# EAGLE design Bozarth_Laser_1 (EAGLE 7.6.0)
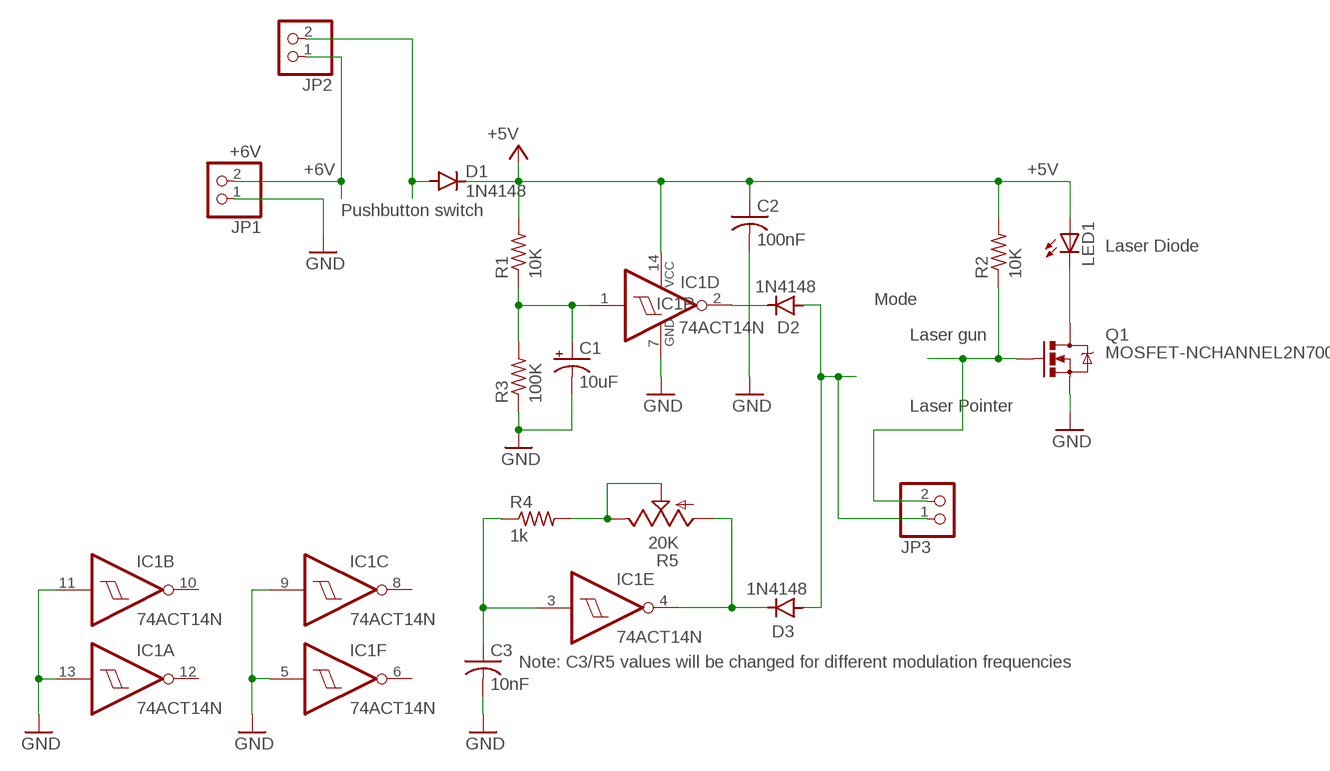
[diagram p0: schematic, sheet 1]

## Parts
C1  10uF  CPOL-USE2-5  [E2-5]
C2  100nF  C-US025-025X050  [C025-025X050]
C3  10nF  C-US025-025X050  [C025-025X050]
D1  1N4148  [0207/2V-D]
D2  1N4148  [0207/2V-D]
D3  1N4148  [0207/2V-D]
IC1  74ACT14N  [DIL14]
JP1  +6V  PINHD-1X2  [1X02]
JP2  PINHD-1X2  [1X02]
JP3  PINHD-1X2  [1X02]
LED1  LED5MM  [LED5MM]
Q1  MOSFET-NCHANNEL2N7000  [TO-92]
R1  10K  R-US_0207/10  [0207/10]
R2  10K  R-US_0207/10  [0207/10]
R3  100K  R-US_0207/10  [0207/10]
R4  1k  R-US_0207/10  [0207/10]
R5  20K  TRIM_US-B64Y  [B64Y]

## Nets
+5V: C2.1 D1.K(C) IC1.14(P:VCC) LED1.A R1.2 R2.2
+6V: JP1.2 JP2.1
GND: C1.- C2.2 C3.2 IC1.5(F:I) IC1.7(P:GND) IC1.9(C:I) IC1.11(B:I) IC1.13(A:I) JP1.1 Q1.1(S) R3.1
N$1: C1.+ IC1.1(D:I) R1.1 R3.2
N$2: D2.A D3.A JP3.1
N$3: LED1.K(C) Q1.3(D)
N$4: D1.A JP2.2
N$9: D2.K(C) IC1.2(D:O)
N$14: D3.K(C) IC1.4(E:O) R5.A
N$15: R4.2 R5.E R5.S
N$16: C3.1 IC1.3(E:I) R4.1
N$21: JP3.2 Q1.2(G) R2.1
Unconnected: IC1.6(F:O) IC1.8(C:O) IC1.10(B:O) IC1.12(A:O)

## Notes on the sheet
- Pushbutton switch
- Laser Diode
- Mode
- Laser gun
- Laser Pointer
- Note: C3/R5 values will be changed for different modulation frequencies

## Library data of the parts
C1 = rcl:CPOL-US: POLARIZED CAPACITOR, American symbol
C2 C3 = rcl:C-US: CAPACITOR, American symbol
D1-D3 = ideal_elements:1N4148
IC1 = 74xx-eu:74*14: Hex schmitt trigger INVERTER
JP1-JP3 = pinhead:PINHD-1X2: PIN HEADER
LED1 = led:LED: LED OSRAM: - CHIPLED LG R971, LG N971, LY N971, LG Q971, LY Q971, LO R971, LY R971 LH N974, LH R974 LS Q976, LO Q976, LY Q976 LO Q996 - Hyper CHIPLED LW Q18S LB Q993, LB Q99A, LB R99A - SideLED LS A670, LO A670, LY A670, LG A670, LP A670 LB A673, LV A673, LT A673, LW A673 LH A674 LY A675 LS A676, LA A676, LO A676, LY A676, LW A676 LS A679, LY A679, LG A679 - Hyper Micro SIDELED® LS Y876, LA Y876, LO Y876, LY Y876 LT Y87S - SmartLED LW L88C, LW L88S LB L89C, LB L89S, LG L890 LS L89K, LO L89K, LY L89K LS L896, LA L896, LO L896, LY L896 - TOPLED LS T670, LO T670, LY T670, LG T670, LP T670 LSG T670, LSP T670, LSY T670, LOP T670, LYG T670 LG T671, LOG T671, LSG T671 LB T673, LV T673, LT T673, LW T673 LH T674 LS T676, LA T676, LO T676, LY T676, LB T676, LH T676, LSB T676, LW T676 LB T67C, LV T67C, LT T67C, LS T67K, LO T67K, LY T67K, LW E67C LS E67B, LA E67B, LO E67B, LY E67B, LB E67C, LV E67C, LT E67C LW T67C LS T679, LY T679, LG T679 LS T770, LO T770, LY T770, LG T770, LP T770 LB T773, LV T773, LT T773, LW T773 LH T774 LS E675, LA E675, LY E675, LS T675 LS T776, LA T776, LO T776, LY T776, LB T776 LHGB T686 LT T68C, LB T68C - Hyper Mini TOPLED® LB M676 - Mini TOPLED Santana® LG M470 LS M47K, LO M47K, LY M47K Source: http://www.osram.convergy.de LUXEON: - LUMILED® LXK2-PW12-R00, LXK2-PW12-S00, LXK2-PW14-U00, LXK2-PW14-V00 LXK2-PM12-R00, LXK2-PM12-S00, LXK2-PM14-U00 LXK2-PE12-Q00, LXK2-PE12-R00, LXK2-PE12-S00, LXK2-PE14-T00, LXK2-PE14-U00 LXK2-PB12-K00, LXK2-PB12-L00, LXK2-PB12-M00, LXK2-PB14-N00, LXK2-PB14-P00, LXK2-PB14-Q00 LXK2-PR12-L00, LXK2-PR12-M00, LXK2-PR14-Q00, LXK2-PR14-R00 LXK2-PD12-Q00, LXK2-PD12-R00, LXK2-PD12-S00 LXK2-PH12-R00, LXK2-PH12-S00 LXK2-PL12-P00, LXK2-PL12-Q00, LXK2-PL12-R00 Source: www.luxeon.com KINGBRIGHT: KA-3528ASYC Source: www.kingbright.com
Q1 = SparkFun-DiscreteSemi:MOSFET-NCHANNEL: Common NMOSFET Parts MFG P/N Store ID Prod ID FDD8780 TRANS-09984 SI7820DN TRANS-11055 FDS6630A IC-08089 2N7002PW TRANS-11151 FQP30N06L COM-10213 TRANS-10060 BSS123LT1G TRANS-08345 BSS138 TRANS-00830 BS170 2N7000
R1-R4 = rcl:R-US_: RESISTOR, American symbol
R5 = JPG_16v1:TRIM_US-: POTENTIOMETER

## Board
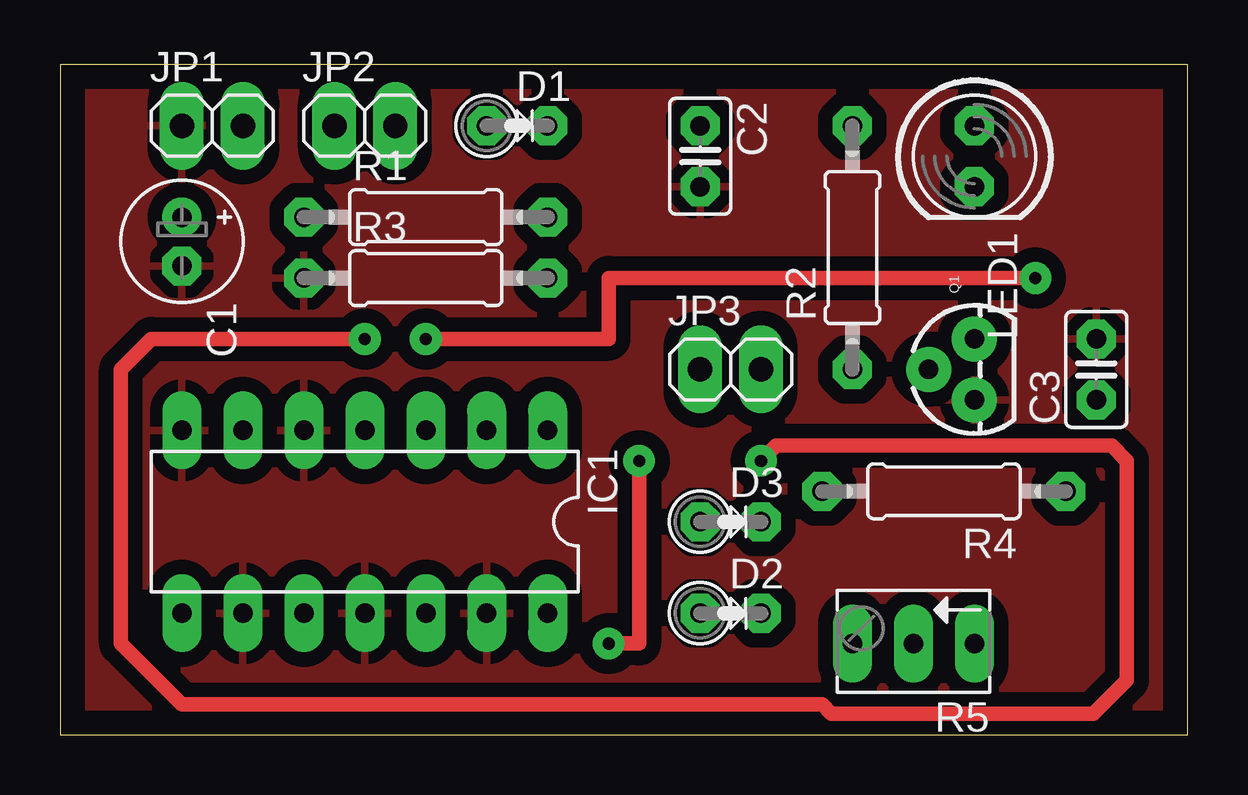
[diagram p1: board, top side]
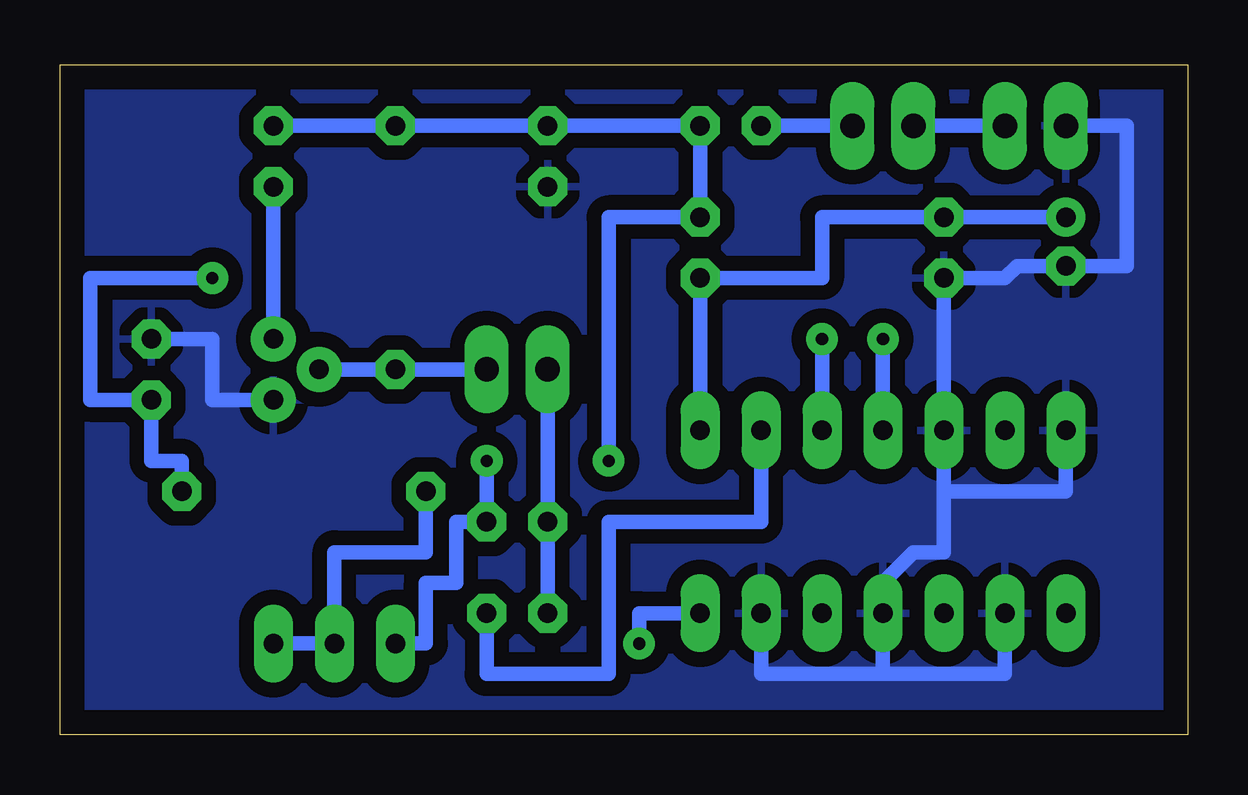
[diagram p2: board, bottom side, seen from below]

Size 46.99 x 27.94 mm. Coordinates in mm from the lower left corner, seen from the top.
Outline: 0,0 46.99,0 46.99,27.94 0,27.94 0,0
Copper layers (1*16): Top 0.035mm / dielectric 1.5mm / Bottom 0.035mm
Design rules "LPKF_HS_1v1": minimum track width 12mil, minimum drill 0.5mm, track to track 8mil, track to pad 8mil, pad to pad 8mil, via to via 8mil, smd to smd 8mil, copper to edge 40mil, drill to drill 8mil, minimum pad ring 16mil, minimum via ring 16mil, stop-mask expansion 4mil, vias tented up to drill 25mil, thermal gap 20mil

### Footprints (pad centres in the part's own frame; a part is rotated, then mirrored left to right if it is on the bottom)
E2-5 = drill 0.813 pad 1.27: + -1.016,0 | drill 0.813 pad 1.27 octagon: - 1.016,0
C025-025X050 = drill 0.813 octagon: 1 -1.27,0; 2 1.27,0
0207/2V-D = drill 0.813 octagon: A -1.27,0; K 1.27,0
DIL14 = drill 0.813 long: 1 -7.62,-3.81; 2 -5.08,-3.81; 3 -2.54,-3.81; 4 0,-3.81; 5 2.54,-3.81; 6 5.08,-3.81; 7 7.62,-3.81; 8 7.62,3.81; 9 5.08,3.81; 10 2.54,3.81; 11 0,3.81; 12 -2.54,3.81; 13 -5.08,3.81; 14 -7.62,3.81
1X02 = drill 1.016 long: 1 -1.27,0; 2 1.27,0
LED5MM = drill 0.813 octagon: A -1.27,0; K 1.27,0
TO-92 = drill 0.813 pad 1.88: 1 -1.27,0; 2 0,1.905; 3 1.27,0
0207/10 = drill 0.813 octagon: 1 -5.08,0; 2 5.08,0
B64Y = drill 0.813 long: A 2.54,0; E -2.54,0; S 0,0

### Placement (x,y rotation side)
C1  5.08,20.57 270 top
C2  26.67,24.13 270 top
C3  43.18,15.24 90 top
D1  19.05,25.4 0 top
D2  27.94,5.08 0 top
D3  27.94,8.89 0 top
IC1  12.7,8.89 180 top
JP1  6.35,25.4 0 top
JP2  12.7,25.4 0 top
JP3  27.94,15.24 0 top
LED1  38.1,24.13 270 top
Q1  38.1,15.24 90 top
R1  15.24,21.59 0 top
R2  33.02,20.32 90 top
R3  15.24,19.05 0 top
R4  36.83,10.16 180 top
R5  35.56,3.81 180 top

### Tracks (layer width: path | path; a pad name or v marks a point on that pad's centre or on a via)
+5V  (via drill 0.51)
  Top 0.61: v24.13,11.43 24.13,3.81 v22.86,3.81
  Bottom 0.61: LED1.A R2.2 C2.1 D1.K R1.2 24.13,21.59 v24.13,11.43 | v22.86,3.81 22.86,5.08 IC1.14
+6V
  Bottom 0.61: JP1.2 JP2.1
GND
  Bottom 0.61: Q1.1 40.64,13.97 40.64,16.51 C3.2 | IC1.13 17.78,2.54 12.7,2.54 | 12.7,2.54 IC1.11 12.7,6.35 11.43,7.62 10.16,7.62 10.16,10.16 | 12.7,2.54 7.62,2.54 IC1.9 | JP1.1 2.54,25.4 2.54,19.56 C1.- 7.11,19.56 7.62,19.05 R3.1 IC1.5 10.16,10.16 | 10.16,10.16 5.08,10.16 IC1.7
  pour Top (isolate 0.61): 0,27.94 46.99,27.94 46.99,0 0,0
  pour Bottom (isolate 0.61): 0,27.94 46.99,27.94 46.99,0 0,0
  pour Top (isolate 0.61): 0,0 46.99,0 46.99,27.94 0,27.94
  pour Bottom (isolate 0.61): 0,27.94 46.99,27.94 46.99,0 0,0
N$1
  Bottom 0.61: C1.+ R1.1 15.24,21.59 15.24,19.05 R3.2 IC1.1
N$2
  Bottom 0.61: JP3.1 D3.A D2.A
N$3
  Bottom 0.61: LED1.K Q1.3
N$4
  Bottom 0.61: JP2.2 D1.A
N$9
  Bottom 0.61: D2.K 29.21,2.54 24.13,2.54 24.13,8.89 17.78,8.89 IC1.2
N$14  (via drill 0.51)
  Top 0.61: v29.21,11.43 29.84,12.06 43.81,12.06 44.45,11.43 44.45,2.29 43.05,0.89 32.13,0.89 31.75,1.27 5.08,1.27 2.54,3.81 2.54,15.24 3.81,16.51 v12.7,16.51
  Bottom 0.61: R5.A 31.75,3.81 31.75,6.35 30.48,6.35 30.48,8.89 D3.K v29.21,11.43 | v12.7,16.51 IC1.4
N$15
  Bottom 0.61: R5.E R5.S 35.56,7.62 31.75,7.62 R4.2
N$16  (via drill 0.51)
  Top 0.61: v15.24,16.51 22.86,16.51 22.86,19.05 v40.64,19.05
  Bottom 0.61: IC1.3 v15.24,16.51 | v40.64,19.05 45.72,19.05 45.72,13.97 C3.1 43.18,11.43 41.91,11.43 R4.1
N$21
  Bottom 0.61: Q1.2 R2.1 JP3.2